# Altium schematic sheet dsp.SchDoc
size 594 x 420 mm; Address1: Address1; Address2: Address2; Address3: Address3; Address4: Address4; DocumentNumber: АБВГ.123456.001 Э3; SheetNumber: 2; SheetTotal: 4; Scale: 1:1; DocumentType: Схема электрическая принципиальная; FirstReferrence: АБВГ.123456.001
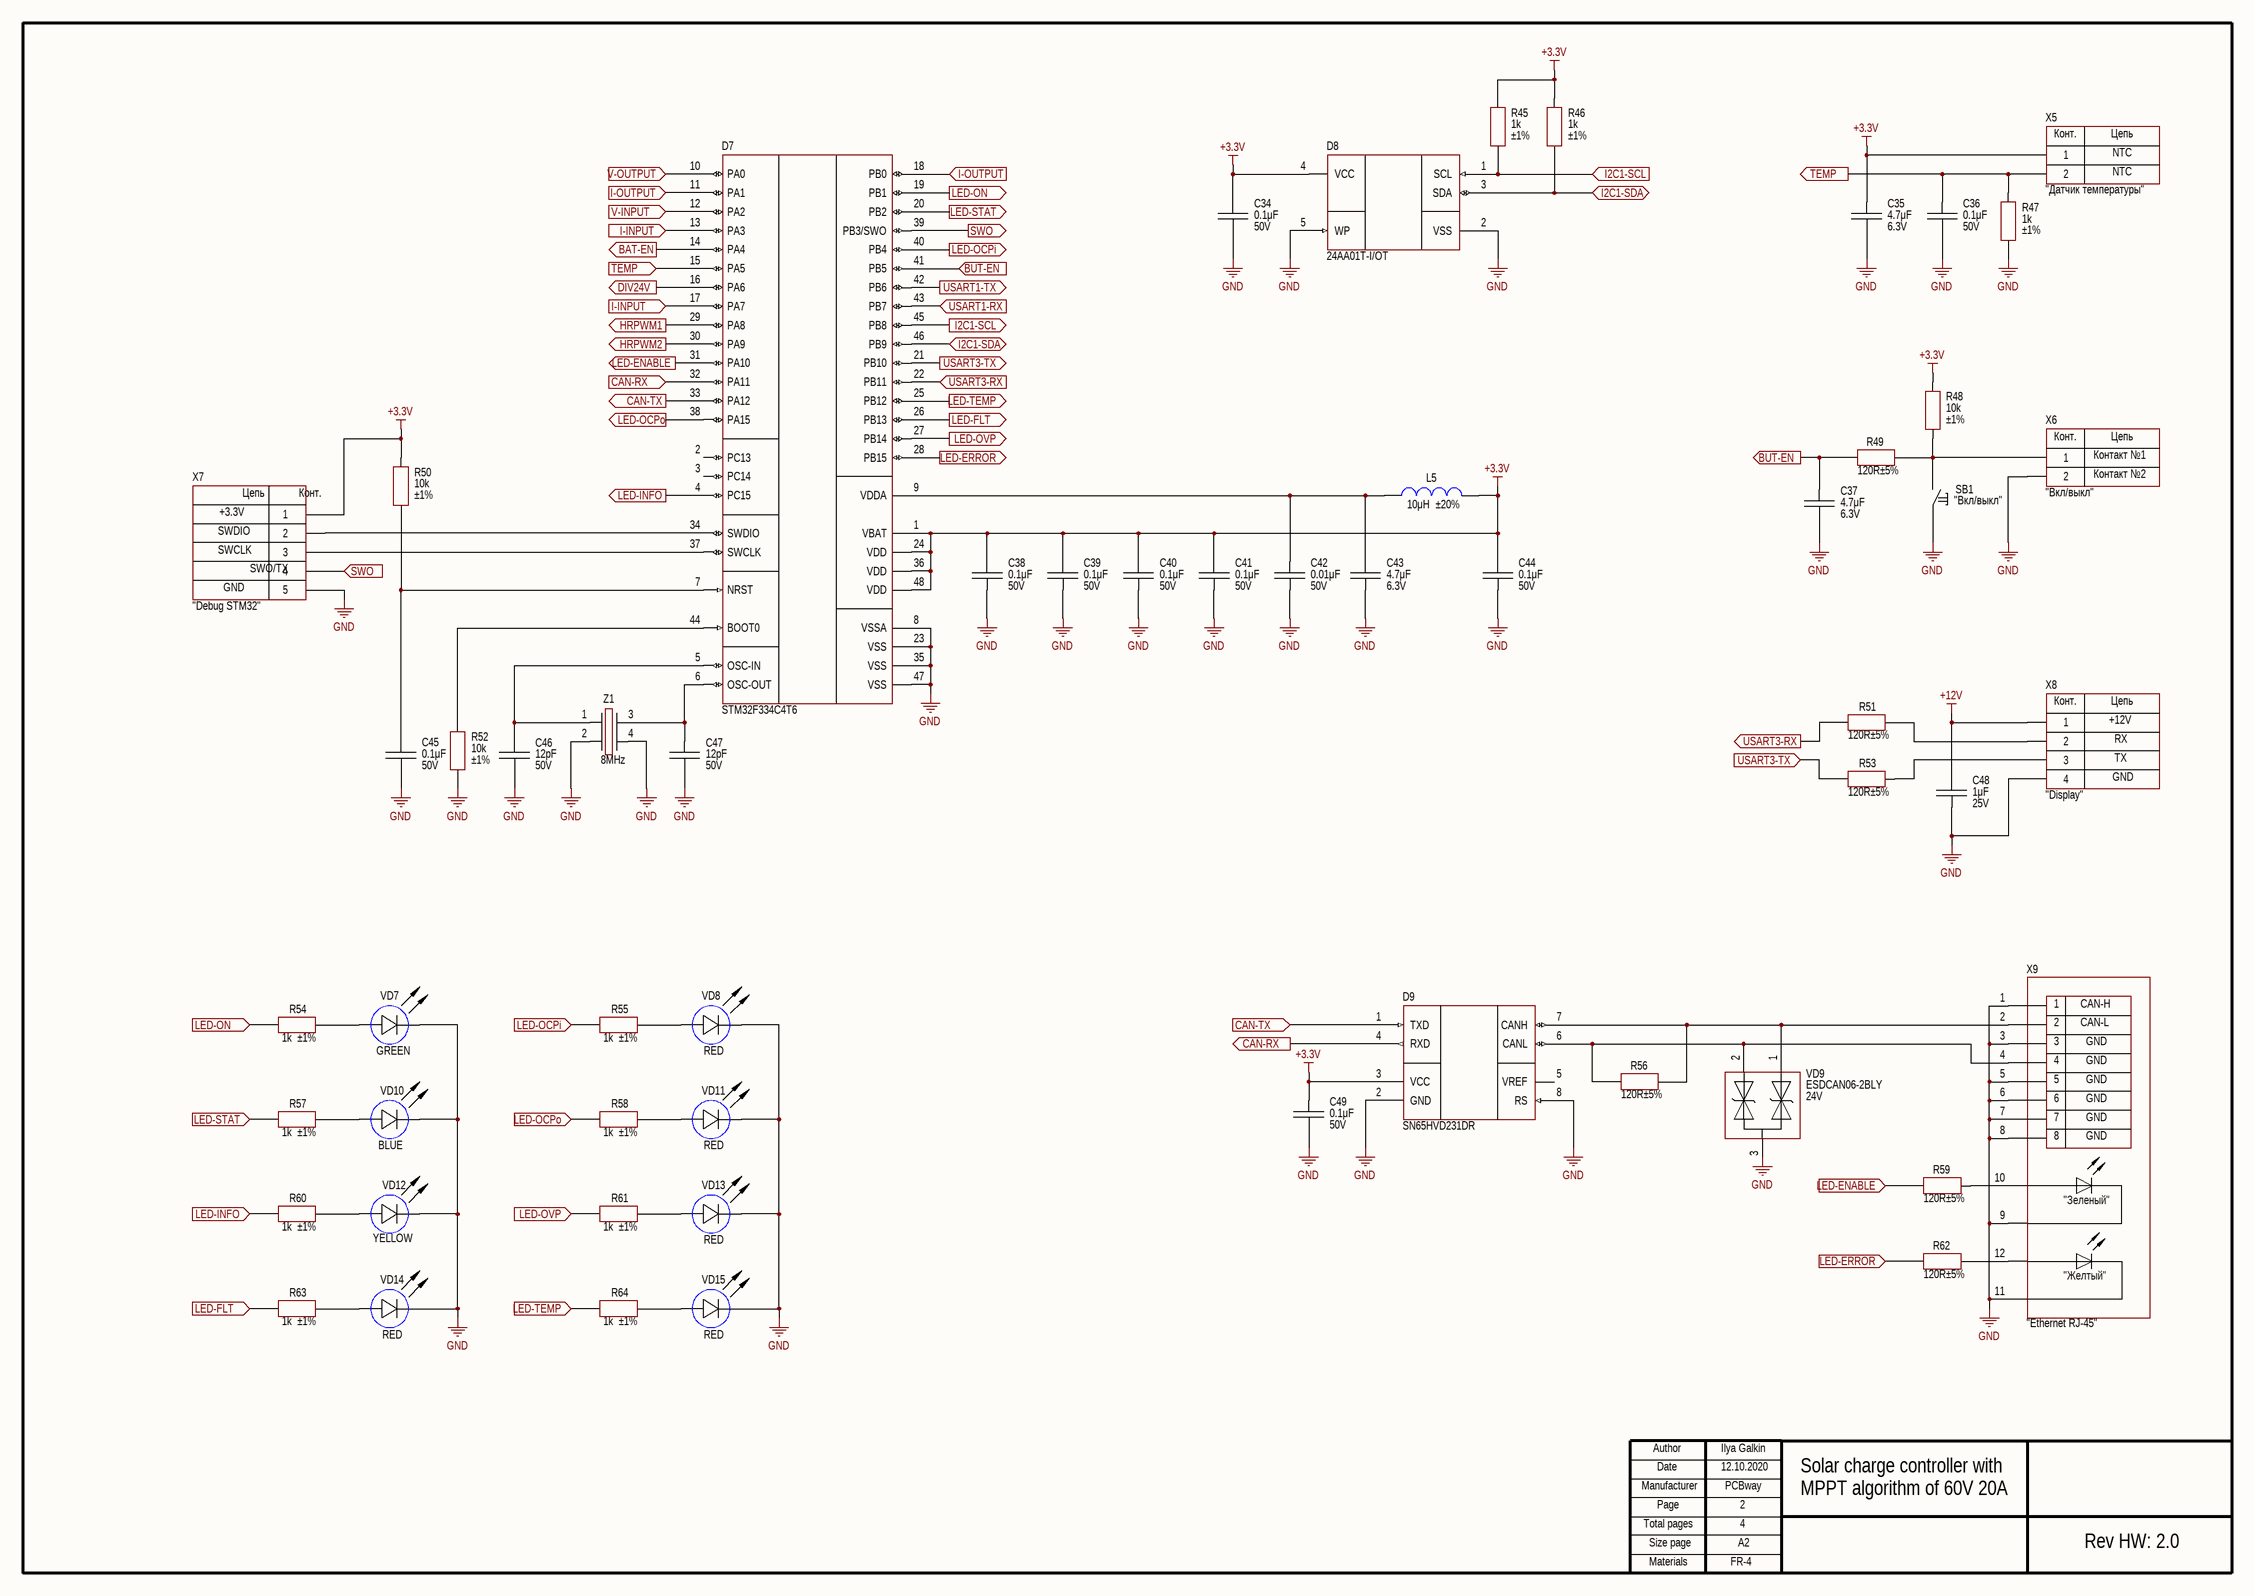
[diagram p0: dsp.SchDoc]

## Parts
C34  value 0.1μF  Voltage: 50V  [CAP: 0603]
C35  value 4.7μF  Voltage: 6.3V  [CAP: 0603]
C36  value 0.1μF  Voltage: 50V  [CAP: 0603]
C37  value 4.7μF  Voltage: 6.3V  [CAP: 0603]
C38  value 0.1μF  Voltage: 50V  [CAP: 0603]
C39  value 0.1μF  Voltage: 50V  [CAP: 0603]
C40  value 0.1μF  Voltage: 50V  [CAP: 0603]
C41  value 0.1μF  Voltage: 50V  [CAP: 0603]
C42  value 0.01μF  Voltage: 50V  [CAP: 0603]
C43  value 4.7μF  Voltage: 6.3V  [CAP: 0603]
C44  value 0.1μF  Voltage: 50V  [CAP: 0603]
C45  value 0.1μF  Voltage: 50V  [CAP: 0603]
C46  value 12pF  Voltage: 50V  [CAP: 0603]
C47  value 12pF  Voltage: 50V  [CAP: 0603]
C48  value 1μF  Voltage: 25V  [CAP: 0603]
C49  value 0.1μF  Voltage: 50V  [CAP: 0603]
D7  PartNumber: STM32F334C4T6  [48-LQFP]
D8  PartNumber: 24AA01T-I/OT  [SOT23-5]
D9  (no value)  [8-SOIC]
L5  value 10μH  Tolerance: ±20%  [IND: 0603]
R45  value 1k  Tolerance: ±1%  [RES: 0603]
R46  value 1k  Tolerance: ±1%  [RES: 0603]
R47  value 1k  Tolerance: ±1%  [RES: 0603]
R48  value 10k  Tolerance: ±1%  [RES: 0603]
R49  value 120R  Tolerance: ±5%  [RES: 0603]
R50  value 10k  Tolerance: ±1%  [RES: 0603]
R51  value 120R  Tolerance: ±5%  [RES: 0603]
R52  value 10k  Tolerance: ±1%  [RES: 0603]
R53  value 120R  Tolerance: ±5%  [RES: 0603]
R54  value 1k  Tolerance: ±1%  [RES: 0603]
R55  value 1k  Tolerance: ±1%  [RES: 0603]
R56  value 120R  Tolerance: ±5%  [RES: 0603]
R57  value 1k  Tolerance: ±1%  [RES: 0603]
R58  value 1k  Tolerance: ±1%  [RES: 0603]
R59  value 120R  Tolerance: ±5%  [RES: 0603]
R60  value 1k  Tolerance: ±1%  [RES: 0603]
R61  value 1k  Tolerance: ±1%  [RES: 0603]
R62  value 120R  Tolerance: ±5%  [RES: 0603]
R63  value 1k  Tolerance: ±1%  [RES: 0603]
R64  value 1k  Tolerance: ±1%  [RES: 0603]
SB1  CommentText: "Вкл/выкл"  [BUT: 6x3.5 SMD]
VD7  Color: GREEN  [LED: 0603G]
VD8  Color: RED  [LED: 0603R]
VD9  Voltage: 24V  PartNumber: ESDCAN06-2BLY  [SOT23]
VD10  Color: BLUE  [LED: 0603B]
VD11  Color: RED  [LED: 0603R]
VD12  Color: YELLOW  [LED: 0603Y]
VD13  Color: RED  [LED: 0603R]
VD14  Color: RED  [LED: 0603R]
VD15  Color: RED  [LED: 0603R]
X5  CommentText: "Датчик температуры"  [CON: CWF-2]
X6  CommentText: "Вкл/выкл"  [CON: CWF-2]
X7  CommentText: "Debug STM32"  [CON: SM05B-GHS]
X8  CommentText: "Display"  [CON: CWF-4]
X9  CommentText: "Ethernet RJ-45"  [CON: RJ-45 (615008137421 / DS1128-09-S8B8S)]
Z1  Frequency: 8MHz  [OSC: 3225]

## Ports
BAT-EN (out), BUT-EN (in), BUT-EN (out), CAN-RX (in), CAN-RX (out), CAN-TX (in), CAN-TX (out), DIV24V (out), HRPWM1 (out), HRPWM2 (out), I2C1-SCL (in), I2C1-SCL (out), I2C1-SDA (bidir), I-INPUT (in), I-OUTPUT (in), LED-ENABLE (in), LED-ENABLE (out), LED-ERROR (in), LED-ERROR (out), LED-FLT (in), LED-FLT (out), LED-INFO (in), LED-INFO (out), LED-OCPi (in), LED-OCPi (out), LED-OCPo (in), LED-OCPo (out), LED-ON (in), LED-ON (out), LED-OVP (in), LED-OVP (out), LED-STAT (in), LED-STAT (out), LED-TEMP (in), LED-TEMP (out), SWO (in), SWO (out), TEMP (in), TEMP (out), USART1-RX (in), USART1-TX (out), USART3-RX (in), USART3-RX (out), USART3-TX (in), USART3-TX (out), V-INPUT (in), V-OUTPUT (in)

## Nets
+3.3V: C34.2 C35.2 C38.2 C39.2 C40.2 C41.2 C44.2 C49.2 D7.1(VBAT) D7.24(VDD) D7.36(VDD) D7.48(VDD) D8.4(VCC) D9.3(VCC) L5.2 R45.2 R46.2 R48.2 R50.2 X5.1 X7.1
+12V: C48.2 X8.1
GND: C34.1 C35.1 C36.1 C37.1 C38.1 C39.1 C40.1 C41.1 C42.1 C43.1 C44.1 C45.1 C46.1 C47.1 C48.1 C49.1 D7.8(VSSA) D7.23(VSS) D7.35(VSS) D7.47(VSS) D8.2(VSS) D8.5(WP) D9.2(GND) D9.8(RS) R47.1 R52.1 SB1.1 VD7.2(C) VD8.2(C) VD9.3 VD10.2(C) VD11.2(C) VD12.2(C) VD13.2(C) VD14.2(C) VD15.2(C) X6.2 X7.5 X8.4 X9.1(D2) X9.3(D2) X9.5(D2) X9.6(D2) X9.7(D2) X9.8(D2) X9.9(D2) X9.11(D3) Z1.2 Z1.4
BAT-EN: D7.14(PA4) ; port BAT-EN
BUT-EN: C37.2 D7.41(PB5) R49.1 ; port BUT-EN
CAN-RX: D7.32(PA11) D9.4(RXD) ; port CAN-RX
CAN-TX: D7.33(PA12) D9.1(TXD) ; port CAN-TX
DIV24V: D7.16(PA6) ; port DIV24V
HRPWM1: D7.29(PA8) ; port HRPWM1
HRPWM2: D7.30(PA9) ; port HRPWM2
I2C1-SCL: D7.45(PB8) D8.1(SCL) R45.1 ; port I2C1-SCL
I2C1-SDA: D7.46(PB9) D8.3(SDA) R46.1 ; port I2C1-SDA
I-INPUT: D7.13(PA3) D7.17(PA7) ; port I-INPUT
I-OUTPUT: D7.11(PA1) D7.18(PB0) ; port I-OUTPUT
LED-ENABLE: D7.31(PA10) R59.1 ; port LED-ENABLE
LED-ERROR: D7.28(PB15) R62.1 ; port LED-ERROR
LED-FLT: D7.26(PB13) R63.2 ; port LED-FLT
LED-INFO: D7.4(PC15) R60.2 ; port LED-INFO
LED-OCPi: D7.40(PB4) R55.2 ; port LED-OCPi
LED-OCPo: D7.38(PA15) R58.2 ; port LED-OCPo
LED-ON: D7.19(PB1) R54.2 ; port LED-ON
LED-OVP: D7.27(PB14) R61.2 ; port LED-OVP
LED-STAT: D7.20(PB2) R57.2 ; port LED-STAT
LED-TEMP: D7.25(PB12) R64.2 ; port LED-TEMP
SWO: D7.39(PB3/SWO) X7.4 ; port SWO
TEMP: C36.2 D7.15(PA5) R47.2 X5.2 ; port TEMP
USART1-RX: D7.43(PB7) ; port USART1-RX
USART1-TX: D7.42(PB6) ; port USART1-TX
USART3-RX: D7.22(PB11) R51.1 ; port USART3-RX
USART3-TX: D7.21(PB10) R53.1 ; port USART3-TX
V-INPUT: D7.12(PA2) ; port V-INPUT
V-OUTPUT: D7.10(PA0) ; port V-OUTPUT
NetC42_2: C42.2 C43.2 D7.9(VDDA) L5.1
NetC45_2: C45.2 D7.7(NRST) R50.1
NetC46_2: C46.2 D7.5(OSC-IN) Z1.1
NetC47_2: C47.2 D7.6(OSC-OUT) Z1.3
NetD7_34: D7.34(SWDIO) X7.2
NetD7_37: D7.37(SWCLK) X7.3
NetD7_44: D7.44(BOOT0) R52.2
NetD9_6: D9.6(CANL) R56.1 VD9.2 X9.4(D2)
NetD9_7: D9.7(CANH) R56.2 VD9.1 X9.2(D2)
NetR48_1: R48.1 R49.2 SB1.2 X6.1
NetR51_2: R51.2 X8.2
NetR53_2: R53.2 X8.3
NetR54_1: R54.1 VD7.1(A)
NetR55_1: R55.1 VD8.1(A)
NetR57_1: R57.1 VD10.1(A)
NetR58_1: R58.1 VD11.1(A)
NetR59_2: R59.2 X9.10(D1)
NetR60_1: R60.1 VD12.1(A)
NetR61_1: R61.1 VD13.1(A)
NetR62_2: R62.2 X9.12(D4)
NetR63_1: R63.1 VD14.1(A)
NetR64_1: R64.1 VD15.1(A)

Not connected (* = marked no-connect by the designer): D7 2(PC13) 3(PC14); D9 5(VREF)

## Notes on the sheet
- NTC
- Контакт №1
- Контакт №2
- SWCLK
- SWDIO
- +3.3V
- GND
- SWO/TX
- +12V
- RX
- TX
- CAN-H
- CAN-L
- Ilya Galkin
- 12.10.2020
- PCBway
- 2
- Solar charge controller with
- MPPT algorithm of 60V 20A
- 4
- Rev HW: 2.0
- FR-4
- Author
- Manufacturer
- Date
- Page
- Total pages
- Size page
- A2
- Materials
- (in symbol Connector_RJ45) "Зеленый"; "Желтый"
- (in symbol Connector_SM05B) Цепь; Конт.
- (in symbol CWF-2) Конт.; Цепь
- (in symbol CWF-4) Конт.; Цепь

## Library data of the parts
C34 C36 = Ceramic_0603: Manufacturer: Yageo; PartNumber: CL10B104KB8WPND; ValueManufacturerPartNumber: Ceramic capacitor, 0.1μF, X7R, ±10%, 50V, 0603, -55...+125°C; TypeCapacitor: Ceramic capacitor; Tolerance: ±10%; TypeDielectric: X7R; Package: 0603; HelpURL: https://www.digikey.com/product-detail/en/samsung-electro-mechanics/CL10B104KB8WPND/1276-CL10B104KB8WPNDCT-ND/11488014; Temperature: -55...+125°C
C35 C37 C43 = Ceramic_0603: Manufacturer: Samsung; PartNumber: CL10B475KQ8NQNC; ValueManufacturerPartNumber: Ceramic capacitor, 4.7μF, X7R, ±10%, 6.3V, 0603, -55...+125°C; TypeCapacitor: Ceramic capacitor; Tolerance: ±10%; TypeDielectric: X7R; Package: 0603; HelpURL: https://www.digikey.com/en/products/detail/samsung-electro-mechanics/CL10B475KQ8NQNC/3887745; Temperature: -55...+125°C
C38-C41 C44 C45 C49 = Ceramic_0603: Manufacturer: Samsung; PartNumber: CL10B104KB8WPND; ValueManufacturerPartNumber: Ceramic capacitor, 0.1μF, X7R, ±10%, 50V, 0603, -55...+125°C; TypeCapacitor: Ceramic capacitor; Tolerance: ±10%; TypeDielectric: X7R; Package: 0603; HelpURL: https://www.digikey.com/product-detail/en/samsung-electro-mechanics/CL10B104KB8WPND/1276-CL10B104KB8WPNDCT-ND/11488014; Temperature: -55...+125°C
C42 = Ceramic_0603: Manufacturer: Samsung; PartNumber: CL10B103KB8NNNC; ValueManufacturerPartNumber: Ceramic capacitor, 0.01μF, X7R, ±10%, 50V, 0603, -55...+125°C; TypeCapacitor: Ceramic capacitor; Tolerance: ±10%; TypeDielectric: X7R; Package: 0603; HelpURL: https://www.digikey.com/product-detail/en/samsung-electro-mechanics/CL10B103KB8NNNC/1276-1009-1-ND/3889095; Temperature: -55...+125°C
C46 C47 = Ceramic_0603: Manufacturer: Samsung; PartNumber: CL10C120JB8NNNC; ValueManufacturerPartNumber: Ceramic capacitor, 12pF, NPO, ±10%, 50V, 0603, -55...+125°C; TypeCapacitor: Ceramic capacitor; Tolerance: ±10%; TypeDielectric: NPO; Package: 0603; HelpURL: https://www.digikey.com/product-detail/en/samsung-electro-mechanics/CL10C120JB8NNNC/1276-1254-1-ND/3889340; Temperature: -55...+125°C
C48 = Ceramic_0603: Manufacturer: Samsung; PartNumber: CL10B105KA8NNNC; ValueManufacturerPartNumber: Ceramic capacitor, 1μF, X7R, ±10%, 25V, 0603, -55...+125°C; TypeCapacitor: Ceramic capacitor; Tolerance: ±10%; TypeDielectric: X7R; Package: 0603; HelpURL: https://www.digikey.com/product-detail/en/samsung-electro-mechanics/CL10B105KA8NNNC/1276-1184-1-ND/3889270; Temperature: -55...+125°C
D7 = STM32F334C8T6: Cortex-M4; Manufacturer: STMicroelectronics; ValueManufacturerPartNumber: IC microcontroller, 32-Bit, Cortex-M4, 72MHz, 16KB, 12KB, 2...3.6V, -40...+85°C, 48-LQFP; Supply: 2...3.6V; Speed: 72MHz; CoreSize: 32-Bit; MemoryROM: 16KB; MemoryRAM: 12KB; HelpURL: https://www.digikey.com/en/products/detail/stmicroelectronics/STM32F334C4T6/4989170?s=N4IgTCBcDaIMoBUCyBmMAxFKAsBhbCAbCALoC%2BQA; Package: 48-LQFP; ComponentType: IC microcontroller; Temperature: -40...+85°C; CoreProcessor: Cortex-M4
D8 = 24AA01T: EEPROM; Manufacturer: Microchip Technology; ValueManufacturerPartNumber: IC memory, EEPROM, 1KB (128x8), 400 kHz, I2C, 1.7...5.5V, -40...+85°C, SOT-23-5; Supply: 1.7...5.5V; Speed: 400 kHz; InterfaceData: I2C; MemorySize: 1KB (128x8); HelpURL: https://www.digikey.com/product-detail/en/microchip-technology/24AA01T-I-OT/24AA01T-I-OTCT-ND/857670; Package: SOT-23-5; ComponentType: IC memory; Temperature: -40...+85°C; MemoryType: EEPROM
D9 = SN65HVD231DR: CAN; Manufacturer: Texas Instruments; ValueManufacturerPartNumber: IC CAN transceiver, 1Mbps, Half-duplex, 3...3.6V, -40...+85°C, 8-SOIC; Supply: 3...3.6V; DataRate: 1Mbps; TypeDuplex: Half-duplex; HelpURL: https://www.digikey.com/product-detail/en/texas-instruments/SN65HVD231DR/296-26343-1-ND/2254977; Package: 8-SOIC; ComponentType: IC CAN transceiver; Temperature: -40...+85°C; PartNumber: SN65HVD231DR
L5 = Inductor_0603: Manufacturer: Murata Electronics; PartNumber: LQM18FN100M00D; ValueManufacturerPartNumber: Fixed inductor, 10μH, ±20%, 0603, 50mA, -55...+125°C; TypeInductor: Fixed inductor; MaxCurrent: 50mA; Package: 0603; HelpURL: https://www.digikey.com/product-detail/en/murata-electronics-north-america/LQM18FN100M00D/490-4025-1-ND/1016285; Temperature: -55...+125°C
R45-R47 R54 R55 R57 R58 R60 R61 R63 R64 = Resistor_0603: Manufacturer: Yageo; PartNumber: RC0603FR-071KL; ValueManufacturerPartNumber: Resistor film, 1k, ±1%, 0603, 0.1W, -55...+125°C; TypeResistor: Resistor film; Power: 0.1W; Package: 0603; HelpURL: https://www.digikey.com/product-detail/en/yageo/RC0603FR-071KL/311-1-00KHRCT-ND/729790; Temperature: -55...+125°C
R48 R50 R52 = Resistor_0603: Manufacturer: Yageo; PartNumber: AC0603FR-0710KL; ValueManufacturerPartNumber: Resistor film, 10k, ±1%, 0603, 0.1W, -55...+125°C; TypeResistor: Resistor film; Power: 0.1W; Package: 0603; HelpURL: https://www.digikey.com/en/products/detail/yageo/AC0603FR-0710KL/2827814; Temperature: -55...+125°C
R49 R51 R53 R56 R59 R62 = Resistor_0603: Manufacturer: Yageo; PartNumber: RC0603JR-07120RL; ValueManufacturerPartNumber: Resistor film, 120R, ±5%, 0603, 0.1W, -55...+125°C; TypeResistor: Resistor film; Power: 0.1W; Package: 0603; HelpURL: https://www.digikey.com/product-detail/en/yageo/RC0603JR-07120RL/311-120GRCT-ND/729653; Temperature: -55...+125°C
SB1 = Button_tactile: Manufacturer: C&K; ValueManufacturerPartNumber: Tactile button, 6x3.5mm; PartNumber: PTS636 SM43; TypeButton: Tactile button; HelpURL: https://www.digikey.com/product-detail/en/c-k/PTS636-SM43-SMTR-LFS/CKN12310-1-ND/10071745; Package: 6x3.5mm
VD7 = LED_single: Manufacturer: Wurth; ValueManufacturerPartNumber: LED, 20mA, 2V, 0603, -55...+150°C; PartNumber: 150060VS75000; TypeDiode: LED; Current: 20mA; VoltageDrop: 2V; Package: 0603; HelpURL: https://www.digikey.com/product-detail/en/w-rth-elektronik/150060VS75000/732-4980-1-ND/4489904; Temperature: -55...+150°C
VD8 VD11 VD13-VD15 = LED_single: Manufacturer: Wurth; ValueManufacturerPartNumber: LED, 20 mA, 2V, 0603, -55...+150°C; PartNumber: 150060RS75000; TypeDiode: LED; Current: 20 mA; VoltageDrop: 2V; Package: 0603; HelpURL: https://www.digikey.com/product-detail/en/w-rth-elektronik/150060RS75000/732-4978-1-ND/4489899; Temperature: -55...+150°C
VD9 = TVS_array: Manufacturer: STMicroelectronics; ValueManufacturerPartNumber: TVS diode, 24V, 230W peak, 3A, 13pF, SOT-23, -40...+150°C; TypeDiode: TVS diode; Current: 230W peak; VoltageDrop: 3A; RecoveryTime: 13pF; Package: SOT-23; HelpURL: https://www.digikey.com/product-detail/en/stmicroelectronics/ESDCAN06-2BLY/497-19090-1-ND/10057130; Temperature: -40...+150°C
VD10 = LED_single: Manufacturer: Wurth; ValueManufacturerPartNumber: LED, 20mA, 3.2V, 0603, -55...+150°C; PartNumber: 150060BS75000; TypeDiode: LED; Current: 20mA; VoltageDrop: 3.2V; Package: 0603; HelpURL: https://www.digikey.com/product-detail/en/w-rth-elektronik/150060BS75000/732-4966-1-ND/4489893; Temperature: -55...+150°C
VD12 = LED_single: Manufacturer: Wurth; ValueManufacturerPartNumber: LED, 20mA, 2V, 0603, -55...+150°C; PartNumber: 150060YS75000; TypeDiode: LED; Current: 20mA; VoltageDrop: 2V; Package: 0603; HelpURL: https://www.digikey.com/product-detail/en/wurth-electronics-inc/150060YS75000/732-4981-1-ND/4489907; Temperature: -55...+150°C
X5 X6 = CWF-2: Manufacturer: Connfly; ValueManufacturerPartNumber: Connector, 2pin, 2.54mm, 250VAC, 3A; TypeConnector: Connector; VoltageMax: 250VAC; Pitch: 2.54mm; CurrentMax: 3A; Multichannel: 2pin; HelpURL: https://www.chipdip.ru/product/cwf-2; PartNumber: CWF-2
X7 = Connector_SM05B: Manufacturer: JST; ValueManufacturerPartNumber: Connector, 5pin, 1.25mm, 50VDC, 1A; PartNumber: SM05B-GHS; VoltageMax: 50VDC; Pitch: 1.25mm; CurrentMax: 1A; Multichannel: 5pin; HelpURL: https://www.digikey.com/product-detail/en/jst-sales-america-inc/SM05B-GHS-TB-LF-SN/455-1567-1-ND/807835; TypeConnector: Connector
X8 = CWF-4: Manufacturer: Connfly; ValueManufacturerPartNumber: Connector, 4pin, 2.54mm, 250VAC, 3A; TypeConnector: Connector; VoltageMax: 250VAC; Pitch: 2.54mm; CurrentMax: 3A; Multichannel: 4pin; HelpURL: https://www.chipdip.ru/product/cwf-4; PartNumber: CWF-4
X9 = Connector_RJ45: Manufacturer: Wurth; ValueManufacturerPartNumber: Etherner RJ-45 connector; PartNumber: 615008137421; AnalogComponent: DS1128-09-S8B8S (Connfly); HelpURL: https://www.digikey.com/product-detail/en/w-rth-elektronik/615008137421/732-2112-ND/2060608; TypeConnector: Etherner RJ-45 connector
Z1 = Crystal_3225: Manufacturer: ECS; PartNumber: ECS-80-12-33-JGN-TR; ValueManufacturerPartNumber: Crystal, 8MHz, 12pF, ±30ppm, case 3225, -40...+85°C; LoadCapacitance: 12pF; Tolerance: ±30ppm; Package: case 3225; HelpURL: https://www.digikey.com/product-detail/en/ecs-inc/ECS-80-12-33-JGN-TR/50-ECS-80-12-33-JGN-CT-ND/10478769; Temperature: -40...+85°C; TypeOscilator: Crystal